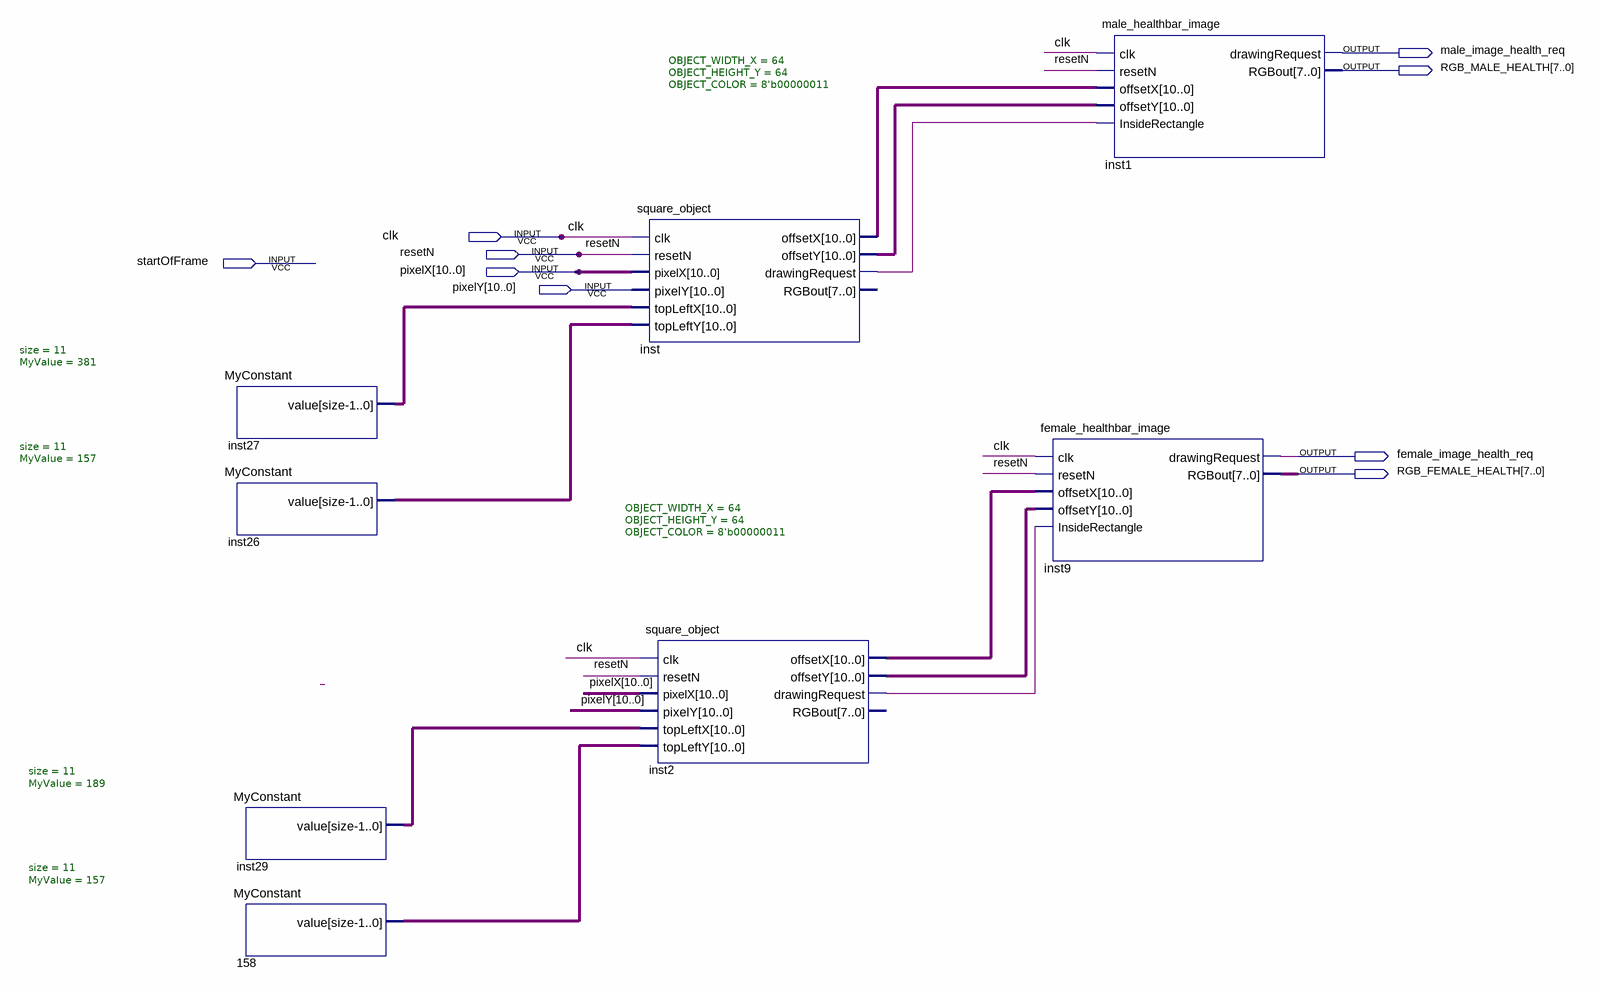
[diagram p0: schematic sheet]
// Quartus schematic healthbar_images_top.bdf as structural Verilog: 8 symbols, 9 pins
module healthbar_images_top (
  input  clk,
  input  resetN,
  input  startOfFrame,
  input  [10:0] pixelX,
  input  [10:0] pixelY,
  output male_image_health_req,
  output [7:0] RGB_MALE_HEALTH,
  output female_image_health_req,
  output [7:0] RGB_FEMALE_HEALTH
);

  wire inst2_drawingrequest, inst_drawingrequest;
  wire [10:0] inst2_offsetx, inst2_offsety, inst26_value, inst27_value, inst29_value, inst_offsetx,
       inst_offsety, n158_value;

  MyConstant #(.size(11), .MyValue(381)) inst27 (.value(inst27_value));
  MyConstant #(.size(11), .MyValue(157)) inst26 (.value(inst26_value));
  MyConstant #(.size(11), .MyValue(189)) inst29 (.value(inst29_value));
  MyConstant #(.size(11), .MyValue(157)) u_158 (.value(n158_value));
  square_object #(.OBJECT_WIDTH_X(64), .OBJECT_HEIGHT_Y(64), .OBJECT_COLOR(8'b00000011)) inst (
    .clk(clk), .resetN(resetN), .pixelX(pixelX), .pixelY(pixelY), .topLeftX(inst27_value),
    .topLeftY(inst26_value), .offsetX(inst_offsetx), .offsetY(inst_offsety),
    .drawingRequest(inst_drawingrequest));  // open: RGBout
  square_object #(.OBJECT_WIDTH_X(64), .OBJECT_HEIGHT_Y(64), .OBJECT_COLOR(8'b00000011)) inst2 (
    .clk(clk), .resetN(resetN), .pixelX(pixelX), .pixelY(pixelY), .topLeftX(inst29_value),
    .topLeftY(n158_value), .offsetX(inst2_offsetx), .offsetY(inst2_offsety),
    .drawingRequest(inst2_drawingrequest));  // open: RGBout
  female_healthbar_image inst9 (
    .clk(clk), .resetN(resetN), .offsetX(inst2_offsetx), .offsetY(inst2_offsety),
    .InsideRectangle(inst2_drawingrequest), .drawingRequest(female_image_health_req),
    .RGBout(RGB_FEMALE_HEALTH));
  male_healthbar_image inst1 (
    .clk(clk), .resetN(resetN), .offsetX(inst_offsetx), .offsetY(inst_offsety),
    .InsideRectangle(inst_drawingrequest), .drawingRequest(male_image_health_req), .RGBout(RGB_MALE_HEALTH));
endmodule
